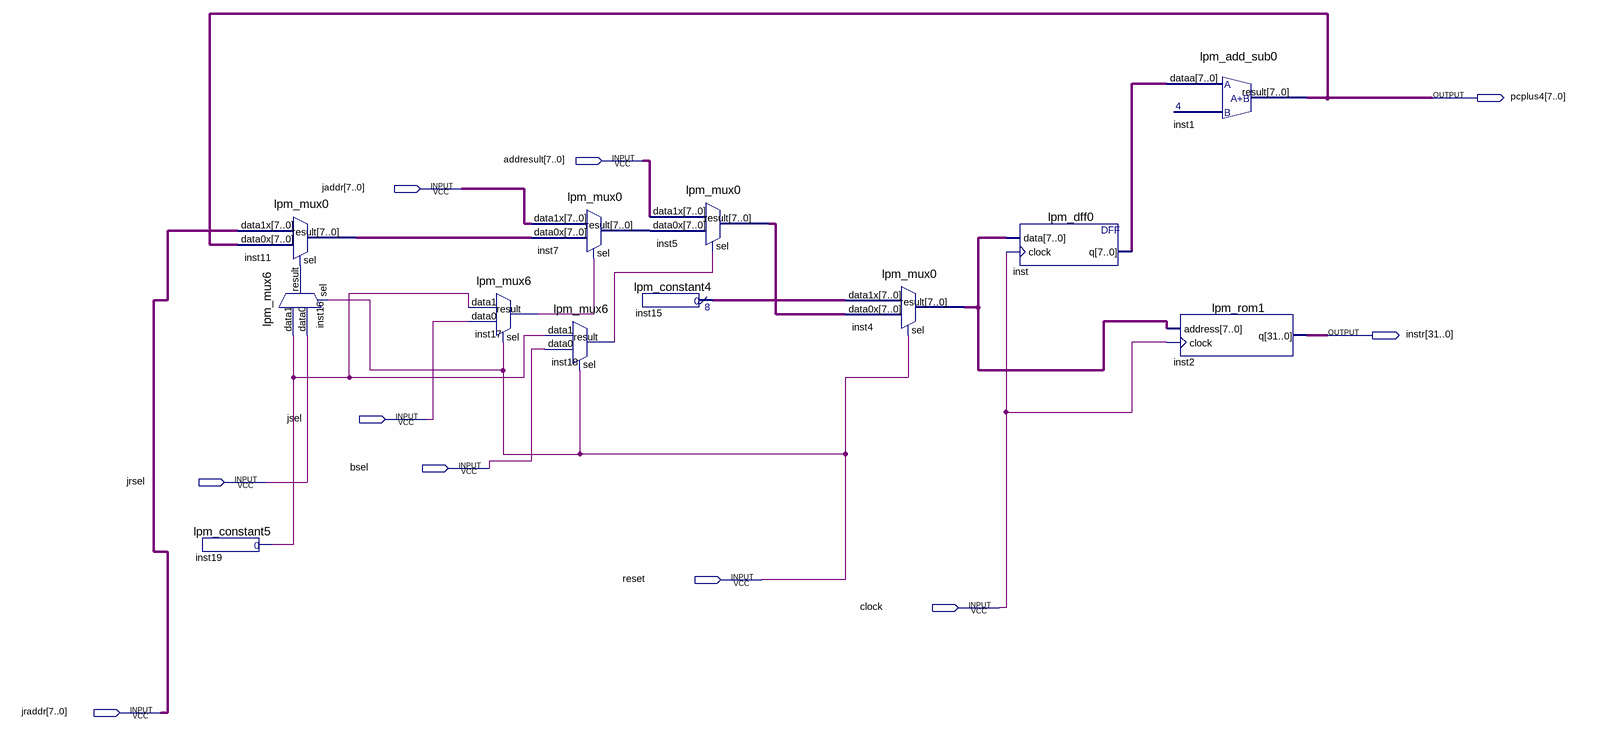
[diagram p0: schematic sheet]
// Quartus schematic fetchpipe.bdf as structural Verilog: 12 symbols, 10 pins
module fetchpipe (
  input  [7:0] addresult,
  input  [7:0] jaddr,
  input  jsel,
  input  bsel,
  input  jrsel,
  input  reset,
  input  clock,
  input  [7:0] jraddr,
  output [7:0] pcplus4,
  output [31:0] instr
);

  wire inst16_result, inst17_result, inst18_result, inst19_result;
  wire [7:0] inst4_result, inst5_result, inst7_result, inst11_result, inst15_result, inst_q;

  lpm_constant5 inst19 (.result(inst19_result));
  lpm_mux0 inst11 (.data1x(jraddr), .data0x(pcplus4), .sel(inst16_result), .result(inst11_result));
  lpm_mux6 inst16 (.data1(inst19_result), .data0(jrsel), .sel(reset), .result(inst16_result));
  lpm_mux6 inst17 (.data1(inst19_result), .data0(jsel), .sel(reset), .result(inst17_result));
  lpm_mux0 inst7 (.data1x(jaddr), .data0x(inst11_result), .sel(inst17_result), .result(inst7_result));
  lpm_mux6 inst18 (.data1(inst19_result), .data0(bsel), .sel(reset), .result(inst18_result));
  lpm_mux0 inst5 (.data1x(addresult), .data0x(inst7_result), .sel(inst18_result), .result(inst5_result));
  lpm_constant4 inst15 (.result(inst15_result));
  lpm_mux0 inst4 (.data1x(inst15_result), .data0x(inst5_result), .sel(reset), .result(inst4_result));
  lpm_dff0 inst (.data(inst4_result), .clock(clock), .q(inst_q));
  lpm_add_sub0 inst1 (.dataa(inst_q), .result(pcplus4));
  lpm_rom1 inst2 (.address(inst4_result), .clock(clock), .q(instr));
endmodule
